# Altium schematic sheet FCC_Peripherals.SchDoc
size A4; SheetNumber: 6; SheetTotal: 8
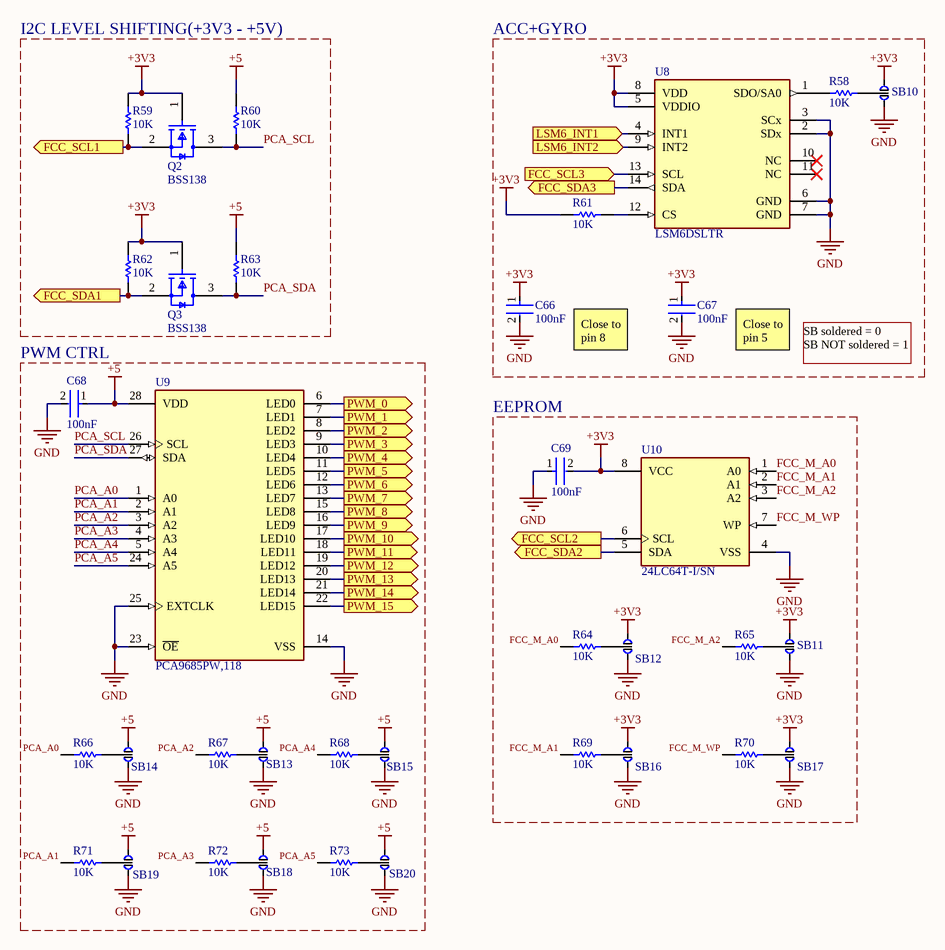
[diagram p0: FCC_Peripherals.SchDoc]

## Parts
C66  100nF  [FP-CGA3E-0_3-0_1-IPC_A]
C67  100nF  [FP-CGA3E-0_3-0_1-IPC_A]
C68  100nF  [FP-CGA3E-0_3-0_1-IPC_A]
C69  100nF  [FP-CGA3E-0_3-0_1-IPC_A]
Q2  BSS138  [FP-318-08-IPC_B]
Q3  BSS138  [FP-318-08-IPC_B]
R58  10K  [RESC1608X55X25ML10T15]
R59  10K  [RESC1608X55X25ML10T15]
R60  10K  [RESC1608X55X25ML10T15]
R61  10K  [RESC1608X55X25ML10T15]
R62  10K  [RESC1608X55X25ML10T15]
R63  10K  [RESC1608X55X25ML10T15]
R64  10K  [RESC1608X55X25ML10T15]
R65  10K  [RESC1608X55X25ML10T15]
R66  10K  [RESC1608X55X25ML10T15]
R67  10K  [RESC1608X55X25ML10T15]
R68  10K  [RESC1608X55X25ML10T15]
R69  10K  [RESC1608X55X25ML10T15]
R70  10K  [RESC1608X55X25ML10T15]
R71  10K  [RESC1608X55X25ML10T15]
R72  10K  [RESC1608X55X25ML10T15]
R73  10K  [RESC1608X55X25ML10T15]
SB10  Solderbridge3P  [SolderBridge3P]  (value not drawn)
SB11  Solderbridge3P  [SolderBridge3P]  (value not drawn)
SB12  Solderbridge3P  [SolderBridge3P]  (value not drawn)
SB13  Solderbridge3P  [SolderBridge3P]  (value not drawn)
SB14  Solderbridge3P  [SolderBridge3P]  (value not drawn)
SB15  Solderbridge3P  [SolderBridge3P]  (value not drawn)
SB16  Solderbridge3P  [SolderBridge3P]  (value not drawn)
SB17  Solderbridge3P  [SolderBridge3P]  (value not drawn)
SB18  Solderbridge3P  [SolderBridge3P]  (value not drawn)
SB19  Solderbridge3P  [SolderBridge3P]  (value not drawn)
SB20  Solderbridge3P  [SolderBridge3P]  (value not drawn)
U8  LSM6DSLTR  [FP-LGA-14L-DM00249496-MFG]
U9  PCA9685PW,118  [FP-SOT361-1-MFG]
U10  24LC64T-I/SN  [FP-C04-057-SN-MFG]

## Blocks framed on the sheet
I2C LEVEL SHIFTING(+3V3 - +5V): Q2 Q3 R59 R60 R62 R63
ACC+GYRO: C66 C67 R58 R61 SB10 U8
PWM CTRL: C68 R66-R68 R71-R73 SB13-SB15 SB18-SB20 U9
EEPROM: C69 R64 R65 R69 R70 SB11 SB12 SB16 SB17 U10

## Ports
FCC_SCL1 (out, see FCC_MCU[1B]), FCC_SCL2 (out, see FCC_MCU[1B], FCC_MCU[3C]), FCC_SCL3 (in, see FCC_MCU[1A], FCC_MCU[3C]), FCC_SDA1 (out, see FCC_MCU[1B]), FCC_SDA2 (out, see FCC_MCU[1B], FCC_MCU[3C]), FCC_SDA3 (out, see FCC_MCU[2A], FCC_MCU[3C]), LSM6_INT1 (in, see FCC_MCU[1A]), LSM6_INT2 (in, see FCC_MCU[1A]), PWM_0 (out, see FCC_Connectors[1A]), PWM_1 (out, see FCC_Connectors[1A]), PWM_2 (out, see FCC_Connectors[1A]), PWM_3 (out, see FCC_Connectors[1A]), PWM_4 (out, see FCC_Connectors[1A]), PWM_5 (out, see FCC_Connectors[1A]), PWM_6 (out, see FCC_Connectors[1A]), PWM_7 (out, see FCC_Connectors[1A]), PWM_8 (out, see FCC_Connectors[1A]), PWM_9 (out, see FCC_Connectors[1B]), PWM_10 (out, see FCC_Connectors[1B]), PWM_11 (out, see FCC_Connectors[1B]), PWM_12 (out, see FCC_Connectors[1B]), PWM_13 (out, see FCC_Connectors[1B]), PWM_14 (out, see FCC_Connectors[1B]), PWM_15 (out, see FCC_Connectors[1B])

## Nets
+3V3: C66.1 C67.1 C69.2 Q2.1(G) Q3.1(G) R59.2 R61.1 R62.2 SB10.1 SB11.1 SB12.1 SB16.1 SB17.1 U8.5(VDDIO) U8.8(VDD) U10.8(VCC)
+5: C68.1 R60.2 R63.2 SB13.1 SB14.1 SB15.1 SB18.1 SB19.1 SB20.1 U9.28(VDD)
GND: C66.2 C67.2 C68.2 C69.1 SB10.2 SB11.2 SB12.2 SB13.2 SB14.2 SB15.2 SB16.2 SB17.2 SB18.2 SB19.2 SB20.2 U8.2(SDx) U8.3(SCx) U8.6(GND) U8.7(GND) U9.14(VSS) U9.23(~{OE}) U9.25(EXTCLK) U10.4(VSS)
FCC_M_A0: R64.2 U10.1(A0)
FCC_M_A1: R69.2 U10.2(A1)
FCC_M_A2: R65.2 U10.3(A2)
FCC_M_WP: R70.2 U10.7(WP)
FCC_SCL1: Q2.2(S) R59.1 ; port FCC_SCL1
FCC_SCL2: U10.6(SCL) ; port FCC_SCL2
FCC_SCL3: U8.13(SCL) ; port FCC_SCL3
FCC_SDA1: Q3.2(S) R62.1 ; port FCC_SDA1
FCC_SDA2: U10.5(SDA) ; port FCC_SDA2
FCC_SDA3: U8.14(SDA) ; port FCC_SDA3
LSM6_INT1: U8.4(INT1) ; port LSM6_INT1
LSM6_INT2: U8.9(INT2) ; port LSM6_INT2
PCA_A0: R66.1 U9.1(A0)
PCA_A1: R71.1 U9.2(A1)
PCA_A2: R67.1 U9.3(A2)
PCA_A3: R72.1 U9.4(A3)
PCA_A4: R68.1 U9.5(A4)
PCA_A5: R73.1 U9.24(A5)
PCA_SCL: Q2.3(D) R60.1 U9.26(SCL)
PCA_SDA: Q3.3(D) R63.1 U9.27(SDA)
PWM_0: U9.6(LED0) ; port PWM_0
PWM_1: U9.7(LED1) ; port PWM_1
PWM_2: U9.8(LED2) ; port PWM_2
PWM_3: U9.9(LED3) ; port PWM_3
PWM_4: U9.10(LED4) ; port PWM_4
PWM_5: U9.11(LED5) ; port PWM_5
PWM_6: U9.12(LED6) ; port PWM_6
PWM_7: U9.13(LED7) ; port PWM_7
PWM_8: U9.15(LED8) ; port PWM_8
PWM_9: U9.16(LED9) ; port PWM_9
PWM_10: U9.17(LED10) ; port PWM_10
PWM_11: U9.18(LED11) ; port PWM_11
PWM_12: U9.19(LED12) ; port PWM_12
PWM_13: U9.20(LED13) ; port PWM_13
PWM_14: U9.21(LED14) ; port PWM_14
PWM_15: U9.22(LED15) ; port PWM_15
NetR58_1: R58.1 U8.1(SDO/SA0)
NetR58_2: R58.2 SB10.3
NetR61_2: R61.2 U8.12(CS)
NetR64_1: R64.1 SB12.3
NetR65_1: R65.1 SB11.3
NetR66_2: R66.2 SB14.3
NetR67_2: R67.2 SB13.3
NetR68_2: R68.2 SB15.3
NetR69_1: R69.1 SB16.3
NetR70_1: R70.1 SB17.3
NetR71_2: R71.2 SB19.3
NetR72_2: R72.2 SB18.3
NetR73_2: R73.2 SB20.3

Not connected (* = marked no-connect by the designer): U8 10(NC)* 11(NC)*

## Notes on the sheet
- Close to pin 8
- Close to pin 5
- SB soldered = 0
  SB NOT soldered = 1

## Library data of the parts
C66-C69 = CMP-2000-07546-2: Cap Ceramic 100nF 50V X7R 10% Pad SMD 0603 +125°C Automotive T/R; Weight: 7.1E-05oz; Composition: Ceramic; Max Operating Temperature: 125°C; Termination: SMD/SMT; Dielectric: X7R; Length: 1.6mm; Package Quantity: 1; REACH SVHC: No SVHC; Lead Free: Lead Free; Case Code (Metric): 1608; Min Operating Temperature: -55°C; Packaging: Tape and Reel; Tolerance: 10%; Voltage Rating: 50V; Case Code (Imperial): 0603; Capacitance: 100nF; Case/Package: 0603; Voltage Rating (DC): 50V; Depth: 0.8mm; Radiation Hardening: No; Ratings: AEC-Q200; Mount: Surface Mount; Voltage: 50V; Thickness: 0.035inch; Width: 0.8mm; Height: 0.8mm
Q2 Q3 = CMP-07173-000101-1: MOSFET N-CH 50V 220MA SOT-23; Turn-Off Delay Time: 20ns; Element Configuration: Single; Rds On Max: 3.5R; Gate to Source Voltage (Vgs): 20V; Threshold Voltage: 1.3V; Number of Elements: 1; Power Dissipation: 360mW; Rise Time: 9ns; Turn-On Delay Time: 2.5ns; Input Capacitance: 27pF; On-State Resistance: 6R; Lead Free: Lead Free; Length: 2.92mm; Width: 1.3mm; Drain to Source Breakdown Voltage: 50V; Min Operating Temperature: -55°C; REACH SVHC: No SVHC; Packaging: Tape and Reel; Radiation Hardening: No; Height: 0.93mm; Drain to Source Voltage (Vdss): 50V; Current Rating: 220mA; Voltage Rating (DC): 50V; Weight: 0.03g; Continuous Drain Current (ID): 220mA; Number of Pins: 3; Nominal Vgs: 1.3V; Max Power Dissipation: 360mW; Fall Time: 9ns; Drain to Source Resistance: 3.5R; Contact Plating: Tin; Case/Package: SOT-23; Package Quantity: 1; Dual Supply Voltage: 50V; Mount: Surface Mount; Termination: SMD/SMT; Max Operating Temperature: 150°C
R58-R73 = CMP-2100-03667-1: Chip Resistor, 0 Ohm, +/- 5%, 0.1 W, -55 to 155 degC, 0603 (1608 Metric), RoHS, Tape and Reel; Manufacturer: Yageo; Temperature Coefficient: 200ppm/degreesC; Voltage Rating: 50V; Power Rating: 100mW; Resistance: 0mOhm; Width: 0.8mm; Max Operating Temperature: 155degC; Tolerance: 5%; Package Reference: 0603; Height: 0.45mm; Depth: 0.8mm; Package Description: 2-Pin Surface Mount Device, Body 1.6 x 0.8 mm; Termination: SMD/SMT; Package Quantity: 5000; Case/Package: 0603; Case Code (Imperial): 0603; Radiation Hardening: No; Number of Pins: 2; Length: 1.6mm; Lead Free: LeadFree; Voltage Rating (DC): 50V; Military Standard: Not; Datasheet URL: http://www.yageo.com/NewPortal/yageodocoutput?fileName=/pdf/R-Chip/PYu-RC_Group_51_RoHS_L_5.pdf; Manufacturer URL: http://www.yageo.com/; Packaging: TapeandReel; Case Code (Metric): 1608; Min Operating Temperature: -55degC; Composition: ThickFilm; RoHSCompliant: true; Contact Plating: Tin; Datasheet Version: Rev. 5, 10/2016; REACH SVHC: NoSVHC
U8 = CMP-2000-07467-2: IMU ACCEL/GYRO I2C/SPI 14LGA; Manufacturer: STMicroelectronics; Resolution: 16bits; Max Supply Voltage: 3.6V; Sensor Type: Temperature,Accelerometer,Gyroscope; Sensor Output: I2C,SPI; Gyro Range: 125/250/500/1000/2000°/s; Accel Range: 2/4/8/16g; Operating Supply Current: 0.29-0.65mA; Min Supply Voltage: 1.62V; Package: LGA-14L-DM00249496; Temperature Range High: +85°C; Automotive: No; Footprint Url: https://www.st.com/resource/en/technical_note/cd00134799.pdf; Height: 0.86mm; Device Class L1: Sensors; Octopart: https://octopart.com/lsm6dsltr-stmicroelectronics-66358193; Device Class L2: Motion Sensors; Lead Free: Yes; Category: IC; Device Class L3: Inertial Measurement Units (IMUs); ComponentLink2Description: Datasheet; RoHS: TRUE; ComponentLink2URL: https://www.st.com/resource/en/datasheet/lsm6dsl.pdf; Temperature Range Low: -40°C; Manufacturer Part Number: LSM6DSLTR; Mouser Description: iNEMO inertial module: always-on 3D accelerometer and 3D gyroscope; Digikey Description: IMU ACCEL/GYRO I2C/SPI 14LGA; Temperature: -40°C to +85°C
U9 = CMP-1595-00003-3: IC LED DRIVER RGBA 28-TSSOP; Manufacturer: NXP Semiconductors; Max Power Dissipation: 400mW; Dimming: I2C,PWM; Number Of Outputs: 16; Import Ts: 1521846855; Min Supply Voltage: 2.3V; Max Supply Voltage: 5.5V; Output Voltage: 5V; Nominal Supply Current: 6mA; Standoff Height: 0.05mm; Output Current: 25mA; Ciiva Ids: 1426473; Temperature Range Low: -40°C; Footprint Url: https://www.nxp.com/docs/en/package-information/SOT361-1.pdf; Height: 1.1mm; Manufacturer Part Number: PCA9685PW,118; Device Class L2: Power Management ICs; Temperature: -40°C to +85°C; Temperature Range High: +85°C; Digikey Description: IC LED DRIVER RGBA 28-TSSOP; ComponentLink2Description: Datasheet; Device Class L3: LED Drivers; Ambient Temperature Range Low: -40°C; ComponentLink2URL: https://www.nxp.com/docs/en/data-sheet/PCA9685.pdf; Ambient Temperature Range High: +85°C; Device Class L1: Integrated Circuits (ICs); Mouser Description: LED Display Drivers I2C Bus LED Controller 28-Pin; Octopart: https://octopart.com/pca9685pw%2C118-nxp+semiconductors-11853435; Release Date: 1454319143; Lead Free: Yes; Category: IC; RoHS: TRUE; Package: SOT361-1; Automotive: No
U10 = CMP-0159-00199-2: IC EEPROM 64K I2C 400KHZ 8SOIC; Manufacturer: Microchip Technology; Min Supply Voltage: 2.5V; Interface: I2C,2-Wire; Access Time: 900ns; Memory Size: 64Kbits; Max Supply Voltage: 5.5V; Nominal Supply Current: 0.05-100uA; Standoff Height: 0.1mm; Temperature: -40°C to +85°C; Automotive: No; Ambient Temperature Range Low: -40°C; Device Class L1: Integrated Circuits (ICs); Footprint 1 Description: SOIC, 8-Leads, Body 4.9x3.8mm, Pitch 1.27mm, IPC High Density; Octopart: https://octopart.com/24lc64t-i%2Fsn-microchip-451854; Footprint Url: http://ww1.microchip.com/downloads/en/DeviceDoc/08L_SOIC_150_3dot9mm_SN_C04-00057e.pdf; Footprint 0 Description: SOIC, 8-Leads, Body 4.9x3.8mm, Pitch 1.27mm, IPC Medium Density; Memory Type: EEPROM; ComponentLink2Description: Datasheet; Digikey Description: IC EEPROM 64K I2C 400KHZ 8SOIC; Manufacturer Part Number: 24LC64T-I/SN; Temperature Range Low: -40°C; Footprint 2 Description: SOIC, 8-Leads, Body 4.9x3.8mm, Pitch 1.27mm, IPC Low Density; ComponentLink2URL: http://ww1.microchip.com/downloads/en/DeviceDoc/21189T.pdf; RoHS: TRUE; Device Class L2: Memory; Ambient Temperature Range High: +85°C; Mouser Description: EEPROM 8kx8 - 2.5V; Lead Free: Yes; Temperature Range High: +85°C; Frequency: 400kHz; Height: 1.75mm; Package: C04-057-SN; Ipc Land Pattern Name: SOIC127P600X175-8; Category: IC; Device Class L3: EEPROM